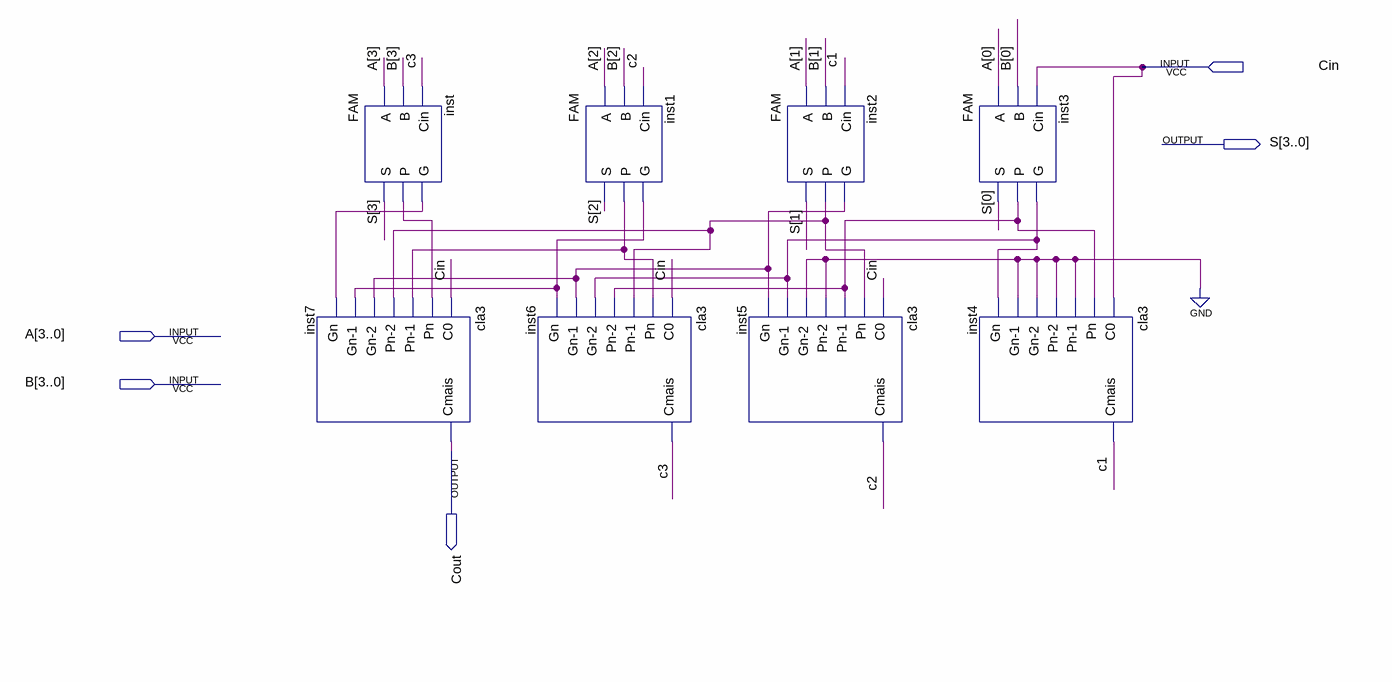
[diagram p0: schematic sheet]
// Quartus schematic cla4.bdf as structural Verilog: 8 symbols, 5 pins
module cla4 (
  input  Cin,
  input  [3:0] A,
  input  [3:0] B,
  output [3:0] S,
  output Cout
);

  wire c1, c2, c3, inst1_g, inst1_p, inst2_g, inst2_p, inst3_g, inst3_p, inst_g, inst_p;

  cla3 inst7 (
    .C0(Cin), .Pn(inst_p), .\Pn-1 (inst1_p), .\Pn-2 (inst2_p), .\Gn-2 (inst2_g), .\Gn-1 (inst1_g),
    .Gn(inst_g), .Cmais(Cout));
  FAM inst (.A(A[3]), .B(B[3]), .Cin(c3), .S(S[3]), .P(inst_p), .G(inst_g));
  FAM inst1 (.A(A[2]), .B(B[2]), .Cin(c2), .S(S[2]), .P(inst1_p), .G(inst1_g));
  cla3 inst6 (
    .C0(Cin), .Pn(inst1_p), .\Pn-1 (inst2_p), .\Pn-2 (inst3_p), .\Gn-2 (inst3_g), .\Gn-1 (inst2_g),
    .Gn(inst1_g), .Cmais(c3));
  FAM inst2 (.A(A[1]), .B(B[1]), .Cin(c1), .S(S[1]), .P(inst2_p), .G(inst2_g));
  cla3 inst5 (
    .C0(Cin), .Pn(inst2_p), .\Pn-1 (inst3_p), .\Pn-2 (1'b0), .\Gn-2 (1'b0), .\Gn-1 (inst3_g), .Gn(inst2_g),
    .Cmais(c2));
  FAM inst3 (.A(A[0]), .B(B[0]), .Cin(Cin), .S(S[0]), .P(inst3_p), .G(inst3_g));
  cla3 inst4 (
    .C0(Cin), .Pn(inst3_p), .\Pn-1 (1'b0), .\Pn-2 (1'b0), .\Gn-2 (1'b0), .\Gn-1 (1'b0), .Gn(inst3_g),
    .Cmais(c1));
endmodule
